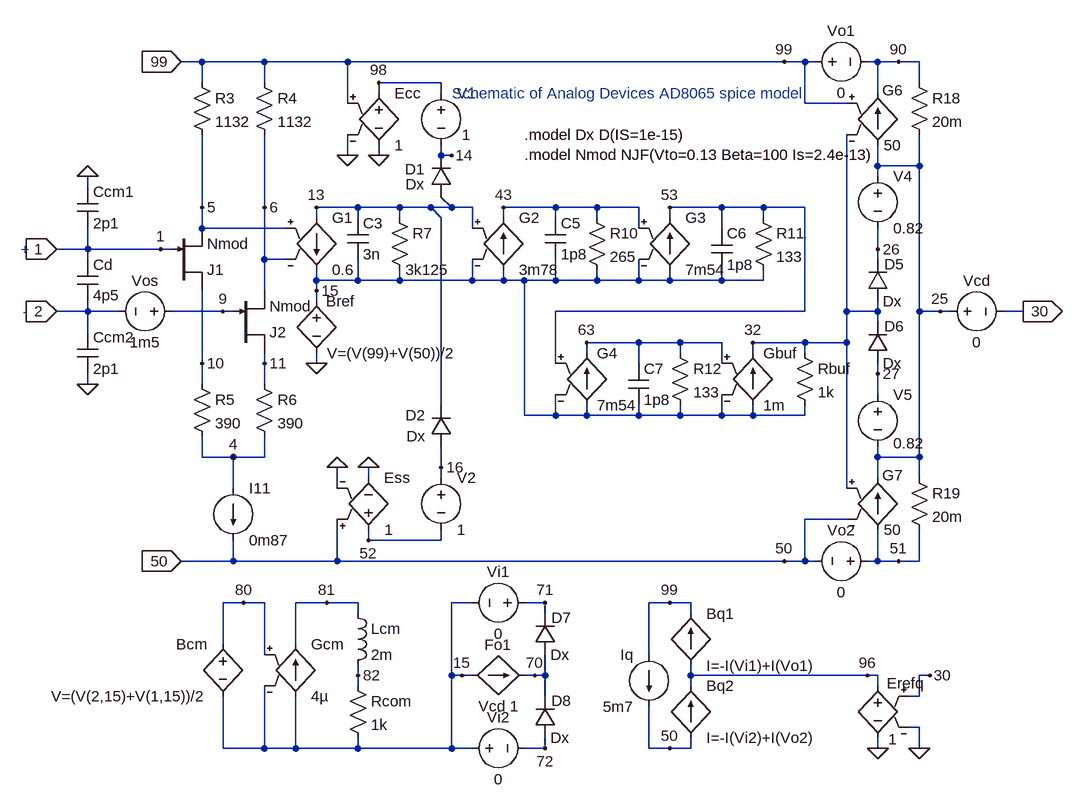
[diagram p0: schematic AD8065old.asc]
AD8065old.asc, the LTspice schematic file:
Version 4
SHEET 1 1504 936
WIRE 144 -176 112 -176
WIRE 240 -176 144 -176
WIRE 368 -176 240 -176
WIRE 1040 -176 368 -176
WIRE 1072 -176 1040 -176
WIRE 1088 -176 1072 -176
WIRE 1184 -176 1168 -176
WIRE 1216 -176 1184 -176
WIRE 1248 -176 1216 -176
WIRE 144 -144 144 -176
WIRE 240 -144 240 -176
WIRE 512 -144 416 -144
WIRE 1248 -144 1248 -176
WIRE 416 -128 416 -144
WIRE 512 -128 512 -144
WIRE 1184 -128 1184 -176
WIRE 368 -112 368 -176
WIRE 1072 -112 1072 -176
WIRE 1136 -112 1072 -112
WIRE 368 -32 368 -64
WIRE 416 -32 416 -48
WIRE 512 -32 512 -48
WIRE 528 -32 512 -32
WIRE 512 -16 512 -32
WIRE 1184 -16 1184 -48
WIRE 1248 -16 1248 -64
WIRE 1248 -16 1184 -16
WIRE 1184 0 1184 -16
WIRE -32 16 -32 0
WIRE 144 48 144 -64
WIRE 240 48 240 -64
WIRE 384 48 320 48
WIRE 448 48 384 48
WIRE 496 48 448 48
WIRE 528 48 512 32
WIRE 528 48 496 48
WIRE 560 48 528 48
WIRE 688 48 608 48
WIRE 752 48 688 48
WIRE 816 48 752 48
WIRE 944 48 864 48
WIRE 1008 48 944 48
WIRE 1072 48 1008 48
WIRE 320 64 320 48
WIRE 384 64 384 48
WIRE 448 64 448 48
WIRE 512 64 496 48
WIRE 608 64 608 48
WIRE 688 64 688 48
WIRE 752 64 752 48
WIRE 864 64 864 48
WIRE 1008 64 1008 48
WIRE 144 80 144 48
WIRE 272 80 144 80
WIRE 560 80 560 48
WIRE 816 80 816 48
WIRE 944 80 944 48
WIRE -32 112 -32 80
WIRE -32 112 -80 112
WIRE 80 112 -32 112
WIRE 96 112 80 112
WIRE 1184 112 1184 80
WIRE -32 128 -32 112
WIRE 240 128 240 48
WIRE 272 128 240 128
WIRE 1184 128 1184 112
WIRE 320 160 320 144
WIRE 384 160 384 128
WIRE 384 160 320 160
WIRE 448 160 448 144
WIRE 448 160 384 160
WIRE 560 160 560 128
WIRE 560 160 448 160
WIRE 608 160 608 144
WIRE 608 160 560 160
WIRE 640 160 608 160
WIRE 688 160 688 128
WIRE 688 160 640 160
WIRE 752 160 752 144
WIRE 752 160 688 160
WIRE 816 160 816 128
WIRE 816 160 752 160
WIRE 864 160 864 144
WIRE 864 160 816 160
WIRE 944 160 944 144
WIRE 944 160 864 160
WIRE 1008 160 1008 144
WIRE 1008 160 944 160
WIRE 240 176 240 128
WIRE 320 176 320 160
WIRE 320 192 320 176
WIRE -32 208 -32 192
WIRE -32 208 -80 208
WIRE 16 208 -32 208
WIRE 176 208 96 208
WIRE 192 208 176 208
WIRE 1072 208 1072 48
WIRE 1072 208 688 208
WIRE 1136 208 1136 -64
WIRE 1184 208 1184 192
WIRE 1184 208 1136 208
WIRE 1248 208 1248 -16
WIRE 1280 208 1248 208
WIRE 1296 208 1280 208
WIRE 1408 208 1376 208
WIRE 1184 224 1184 208
WIRE -32 240 -32 208
WIRE 816 256 736 256
WIRE 880 256 816 256
WIRE 944 256 880 256
WIRE 1072 256 992 256
WIRE 1136 256 1136 208
WIRE 1136 256 1072 256
WIRE 736 272 736 256
WIRE 880 272 880 256
WIRE 992 272 992 256
WIRE 1072 272 1072 256
WIRE 144 288 144 176
WIRE 240 288 240 272
WIRE 320 288 320 272
WIRE 688 288 688 208
WIRE 816 288 816 256
WIRE 944 288 944 256
WIRE 1184 304 1184 288
WIRE -32 320 -32 304
WIRE 144 320 144 288
WIRE 240 320 240 288
WIRE 1184 336 1184 304
WIRE 512 352 512 64
WIRE 640 368 640 160
WIRE 688 368 688 336
WIRE 688 368 640 368
WIRE 736 368 736 352
WIRE 736 368 688 368
WIRE 816 368 816 352
WIRE 816 368 736 368
WIRE 880 368 880 352
WIRE 880 368 816 368
WIRE 944 368 944 336
WIRE 944 368 880 368
WIRE 992 368 992 352
WIRE 992 368 944 368
WIRE 1072 368 1072 352
WIRE 1072 368 992 368
WIRE 144 432 144 400
WIRE 192 432 144 432
WIRE 240 432 240 400
WIRE 240 432 192 432
WIRE 1184 432 1184 416
WIRE 1248 432 1248 208
WIRE 1248 432 1184 432
WIRE 512 448 512 416
WIRE 400 464 400 448
WIRE 512 464 512 448
WIRE 1184 464 1184 432
WIRE 1248 464 1248 432
WIRE 192 480 192 432
WIRE 352 480 352 448
WIRE 1136 480 1136 256
WIRE 1136 528 1072 528
WIRE 400 560 400 544
WIRE 512 560 512 544
WIRE 512 560 400 560
WIRE 192 592 192 560
WIRE 192 592 112 592
WIRE 352 592 352 528
WIRE 352 592 192 592
WIRE 1040 592 352 592
WIRE 1072 592 1072 528
WIRE 1072 592 1040 592
WIRE 1088 592 1072 592
WIRE 1184 592 1184 544
WIRE 1184 592 1168 592
WIRE 1216 592 1184 592
WIRE 1248 592 1248 544
WIRE 1248 592 1216 592
WIRE 208 656 176 656
WIRE 240 656 208 656
WIRE 336 656 288 656
WIRE 384 656 336 656
WIRE 560 656 528 656
WIRE 672 656 640 656
WIRE 864 656 832 656
WIRE 896 656 864 656
WIRE 384 672 384 656
WIRE 672 672 672 656
WIRE 896 672 896 656
WIRE 176 720 176 656
WIRE 288 720 288 656
WIRE 240 736 240 656
WIRE 832 736 832 656
WIRE 384 768 384 752
WIRE 528 768 528 656
WIRE 544 768 528 768
WIRE 560 768 544 768
WIRE 656 768 640 768
WIRE 672 768 672 736
WIRE 672 768 656 768
WIRE 896 768 896 752
WIRE 1168 768 896 768
WIRE 1184 768 1168 768
WIRE 1264 768 1248 768
WIRE 384 784 384 768
WIRE 896 784 896 768
WIRE 1184 784 1184 768
WIRE 672 800 672 768
WIRE 1248 800 1248 768
WIRE 1248 800 1232 800
WIRE 1248 848 1232 848
WIRE 176 880 176 800
WIRE 240 880 240 784
WIRE 240 880 176 880
WIRE 288 880 288 800
WIRE 288 880 240 880
WIRE 384 880 384 864
WIRE 384 880 288 880
WIRE 528 880 528 768
WIRE 528 880 384 880
WIRE 560 880 528 880
WIRE 672 880 672 864
WIRE 672 880 640 880
WIRE 832 880 832 816
WIRE 864 880 832 880
WIRE 896 880 896 864
WIRE 896 880 864 880
WIRE 1184 880 1184 864
WIRE 1248 880 1248 848
FLAG -80 112 1
IOPIN -80 112 In
FLAG -80 208 2
IOPIN -80 208 In
FLAG 176 208 9
FLAG -32 320 0
FLAG -32 0 0
FLAG 112 -176 99
IOPIN 112 -176 In
FLAG 144 48 5
FLAG 112 592 50
IOPIN 112 592 In
FLAG 192 432 4
FLAG 240 48 6
FLAG 240 288 11
FLAG 144 288 10
FLAG 80 112 1
FLAG 368 -32 0
FLAG 416 -32 0
FLAG 416 -144 98
FLAG 352 448 0
FLAG 400 448 0
FLAG 400 560 52
FLAG 320 288 0
FLAG 320 176 15
FLAG 320 48 13
FLAG 528 -32 14
FLAG 512 448 16
FLAG 608 48 43
FLAG 864 48 53
FLAG 736 256 63
FLAG 992 256 32
FLAG 1216 592 51
FLAG 1216 -176 90
FLAG 1280 208 25
FLAG 1408 208 30
IOPIN 1408 208 Out
FLAG 1040 -176 99
FLAG 1040 592 50
FLAG 1184 304 27
FLAG 1184 112 26
FLAG 544 768 15
FLAG 656 768 70
FLAG 672 656 71
FLAG 672 880 72
FLAG 1264 768 30
FLAG 1248 880 0
FLAG 1184 880 0
FLAG 1168 768 96
FLAG 864 656 99
FLAG 864 880 50
FLAG 336 656 81
FLAG 208 656 80
FLAG 384 768 82
SYMBOL njf 96 176 M180
SYMATTR InstName J1
SYMATTR Value Nmod
SYMBOL njf 192 272 M180
SYMATTR InstName J2
SYMATTR Value Nmod
SYMBOL cap -48 128 R0
WINDOW 3 24 55 Left 0
SYMATTR InstName Cd
SYMATTR Value 4p5
SYMBOL voltage 112 208 R90
WINDOW 0 -32 56 VBottom 0
WINDOW 3 32 56 VTop 0
SYMATTR InstName Vos
SYMATTR Value 1m5
SYMBOL cap -48 16 R0
WINDOW 3 24 56 Left 0
SYMATTR InstName Ccm1
SYMATTR Value 2p1
SYMBOL cap -48 240 R0
WINDOW 3 24 56 Left 0
SYMATTR InstName Ccm2
SYMATTR Value 2p1
SYMBOL res 128 -160 R0
SYMATTR InstName R3
SYMATTR Value 1132
SYMBOL res 224 -160 R0
SYMATTR InstName R4
SYMATTR Value 1132
SYMBOL current 192 480 R0
WINDOW 3 24 80 Left 0
SYMATTR InstName I11
SYMATTR Value 0m87
SYMBOL res 128 304 R0
SYMATTR InstName R5
SYMATTR Value 390
SYMBOL res 224 304 R0
SYMATTR InstName R6
SYMATTR Value 390
SYMBOL e 416 -144 R0
WINDOW 3 24 96 Left 0
SYMATTR InstName Ecc
SYMATTR Value 1
SYMBOL e 400 560 M180
WINDOW 0 24 96 Left 0
WINDOW 3 25 16 Left 0
SYMATTR InstName Ess
SYMATTR Value 1
SYMBOL bv 320 176 R0
WINDOW 0 15 16 Left 0
WINDOW 3 16 96 Left 0
SYMATTR InstName Bref
SYMATTR Value V=(V(99)+V(50))/2
SYMBOL res 432 48 R0
WINDOW 3 25 96 Left 0
SYMATTR InstName R7
SYMATTR Value 3k125
SYMBOL g2 320 160 M180
WINDOW 0 24 96 Left 0
WINDOW 3 24 16 Left 0
SYMATTR InstName G1
SYMATTR Value 0.6
SYMBOL cap 368 64 R0
SYMATTR InstName C3
SYMATTR Value 3n
SYMBOL voltage 512 -144 R0
WINDOW 3 32 80 Left 0
SYMATTR InstName V1
SYMATTR Value 1
SYMBOL voltage 512 448 R0
SYMATTR InstName V2
SYMATTR Value 1
SYMBOL diode 528 32 R180
WINDOW 0 41 43 Left 0
WINDOW 3 42 20 Left 0
SYMATTR InstName D1
SYMATTR Value Dx
SYMBOL diode 528 416 R180
WINDOW 0 40 48 Left 0
WINDOW 3 40 16 Left 0
SYMATTR InstName D2
SYMATTR Value Dx
SYMBOL g 608 48 R0
WINDOW 3 24 96 Left 0
SYMATTR InstName G2
SYMATTR Value 3m78
SYMBOL cap 672 64 R0
SYMATTR InstName C5
SYMATTR Value 1p8
SYMBOL res 736 48 R0
SYMATTR InstName R10
SYMATTR Value 265
SYMBOL g 864 48 R0
WINDOW 3 24 96 Left 0
SYMATTR InstName G3
SYMATTR Value 7m54
SYMBOL cap 928 80 R0
SYMATTR InstName C6
SYMATTR Value 1p8
SYMBOL res 992 48 R0
SYMATTR InstName R11
SYMATTR Value 133
SYMBOL g 736 256 R0
WINDOW 0 16 16 Left 0
WINDOW 3 16 96 Left 0
SYMATTR InstName G4
SYMATTR Value 7m54
SYMBOL cap 800 288 R0
SYMATTR InstName C7
SYMATTR Value 1p8
SYMBOL res 864 256 R0
SYMATTR InstName R12
SYMATTR Value 133
SYMBOL g 992 256 R0
WINDOW 0 16 16 Left 0
WINDOW 3 16 96 Left 0
SYMATTR InstName Gbuf
SYMATTR Value 1m
SYMBOL res 1056 256 R0
SYMATTR InstName Rbuf
SYMATTR Value 1k
SYMBOL voltage 1072 -176 M90
WINDOW 0 -32 56 VBottom 0
WINDOW 3 32 56 VTop 0
SYMATTR InstName Vo1
SYMATTR Value 0
SYMBOL voltage 1184 592 R90
WINDOW 0 -32 56 VBottom 0
WINDOW 3 32 56 VTop 0
SYMATTR InstName Vo2
SYMATTR Value 0
SYMBOL res 1232 -160 R0
SYMATTR InstName R18
SYMATTR Value 20m
SYMBOL res 1232 448 R0
SYMATTR InstName R19
SYMATTR Value 20m
SYMBOL voltage 1280 208 M90
WINDOW 0 -32 56 VBottom 0
WINDOW 3 32 56 VTop 0
SYMATTR InstName Vcd
SYMATTR Value 0
SYMBOL g 1184 -144 R0
WINDOW 0 7 12 Left 0
WINDOW 3 9 96 Left 0
SYMATTR InstName G6
SYMATTR Value 50
SYMBOL g 1184 448 R0
WINDOW 0 7 12 Left 0
WINDOW 3 9 96 Left 0
SYMATTR InstName G7
SYMATTR Value 50
SYMBOL diode 1168 192 M180
WINDOW 0 26 57 Left 0
WINDOW 3 24 0 Left 0
SYMATTR InstName D5
SYMATTR Value Dx
SYMBOL diode 1168 288 M180
WINDOW 0 26 57 Left 0
WINDOW 3 24 0 Left 0
SYMATTR InstName D6
SYMATTR Value Dx
SYMBOL voltage 1184 -16 R0
WINDOW 3 24 96 Left 0
SYMATTR InstName V4
SYMATTR Value 0.82
SYMBOL voltage 1184 320 R0
WINDOW 3 24 91 Left 0
SYMATTR Value 0.82
SYMATTR InstName V5
SYMBOL f 560 768 R270
WINDOW 0 32 40 VTop 0
WINDOW 3 -32 40 VBottom 0
SYMATTR InstName Fo1
SYMATTR Value Vcd 1
SYMBOL diode 656 736 M180
WINDOW 0 26 57 Left 0
WINDOW 3 24 0 Left 0
SYMATTR InstName D7
SYMATTR Value Dx
SYMBOL diode 656 864 M180
WINDOW 0 26 57 Left 0
WINDOW 3 24 0 Left 0
SYMATTR InstName D8
SYMATTR Value Dx
SYMBOL voltage 656 656 R90
WINDOW 0 -32 56 VBottom 0
WINDOW 3 32 56 VTop 0
SYMATTR InstName Vi1
SYMATTR Value 0
SYMBOL voltage 544 880 M90
WINDOW 0 -32 56 VBottom 0
WINDOW 3 32 56 VTop 0
SYMATTR InstName Vi2
SYMATTR Value 0
SYMBOL e 1184 768 M0
WINDOW 0 -14 12 Right 0
WINDOW 3 -16 98 Right 0
SYMATTR InstName Erefq
SYMATTR Value 1
SYMBOL current 832 736 M0
WINDOW 3 24 80 Left 0
SYMATTR InstName Iq
SYMATTR Value 5m7
SYMBOL bi 896 752 M180
WINDOW 0 24 79 Left 0
WINDOW 3 24 -1 Left 0
SYMATTR InstName Bq1
SYMATTR Value I=-I(Vi1)+I(Vo1)
SYMBOL bi 896 864 M180
WINDOW 0 24 80 Left 0
WINDOW 3 24 0 Left 0
SYMATTR InstName Bq2
SYMATTR Value I=-I(Vi2)+I(Vo2)
SYMBOL g 288 704 R0
WINDOW 3 24 96 Left 0
SYMATTR InstName Gcm
SYMATTR Value 4µ
SYMBOL ind 368 656 R0
WINDOW 39 36 100 Left 0
SYMATTR InstName Lcm
SYMATTR Value 2m
SYMBOL bv 176 704 M0
SYMATTR InstName Bcm
SYMATTR Value V=(V(2,15)+V(1,15))/2
SYMBOL res 368 768 R0
SYMATTR InstName Rcom
SYMATTR Value 1k
TEXT -128 112 Center 0 ;+
TEXT -128 208 Center 0 ;-
TEXT 640 -64 Left 0 !.model Dx D(IS=1e-15)\n.model Nmod NJF(Vto=0.13 Beta=100 Is=2.4e-13)
TEXT 800 -128 Center 0 ;Schematic of Analog Devices AD8065 spice model

The netlist it stands for:
* AD8065old.asc
J1 10 1 5 Nmod
J2 11 9 6 Nmod
Cd 1 2 4p5
Vos 9 2 1m5
Ccm1 0 1 2p1
Ccm2 2 0 2p1
R3 99 5 1132
R4 99 6 1132
I11 4 50 0m87
R5 10 4 390
R6 11 4 390
Ecc 98 0 99 0 1
Ess 52 0 50 0 1
Bref 15 0 V=(V(99)+V(50))/2
R7 13 15 3k125
G1 13 15 5 6 0.6
C3 13 15 3n
V1 98 14 1
V2 16 52 1
D1 13 14 Dx
D2 16 13 Dx
G2 15 43 13 15 3m78
C5 43 15 1p8
R10 43 15 265
G3 15 53 43 15 7m54
C6 53 15 1p8
R11 53 15 133
G4 15 63 53 15 7m54
C7 63 15 1p8
R12 63 15 133
Gbuf 15 32 63 15 1m
Rbuf 32 15 1k
Vo1 99 90 0
Vo2 51 50 0
R18 90 25 20m
R19 25 51 20m
Vcd 25 30 0
G6 25 90 99 32 50
G7 51 25 32 50 50
D5 32 26 Dx
D6 27 32 Dx
V4 25 26 0.82
V5 27 25 0.82
Fo1 15 70 Vcd 1
D7 70 71 Dx
D8 72 70 Dx
Vi1 71 15 0
Vi2 15 72 0
Erefq 96 0 30 0 1
Iq 99 50 5m7
Bq1 96 99 I=-I(Vi1)+I(Vo1)
Bq2 50 96 I=-I(Vi2)+I(Vo2)
Gcm 15 81 80 15 4µ
Lcm 81 82 2m
Bcm 80 15 V=(V(2,15)+V(1,15))/2
Rcom 82 15 1k
.model D D
.lib standard.dio
.model NJF NJF
.model PJF PJF
.lib standard.jft
* +
* -
.model Dx D(IS=1e-15)
.model Nmod NJF(Vto=0.13 Beta=100 Is=2.4e-13)
* Schematic of Analog Devices AD8065 spice model
.backanno
.end